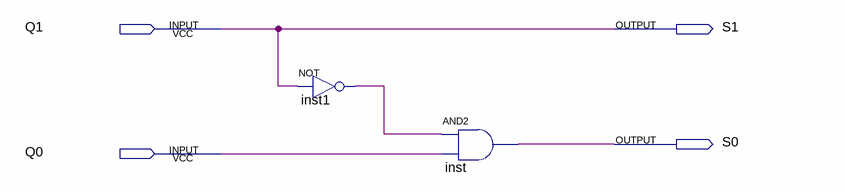
[diagram p0: schematic sheet]
// Quartus schematic DECODE_BLOCK.bdf as structural Verilog: 2 symbols, 4 pins
module DECODE_BLOCK (
  input  Q1,
  input  Q0,
  output S1,
  output S0
);

  wire inst1_out;

  not inst1 (inst1_out, Q1);
  and inst (S0, inst1_out, Q0);

  assign S1 = Q1;
endmodule
